# Altium schematic sheet Port.SchDoc
size A4
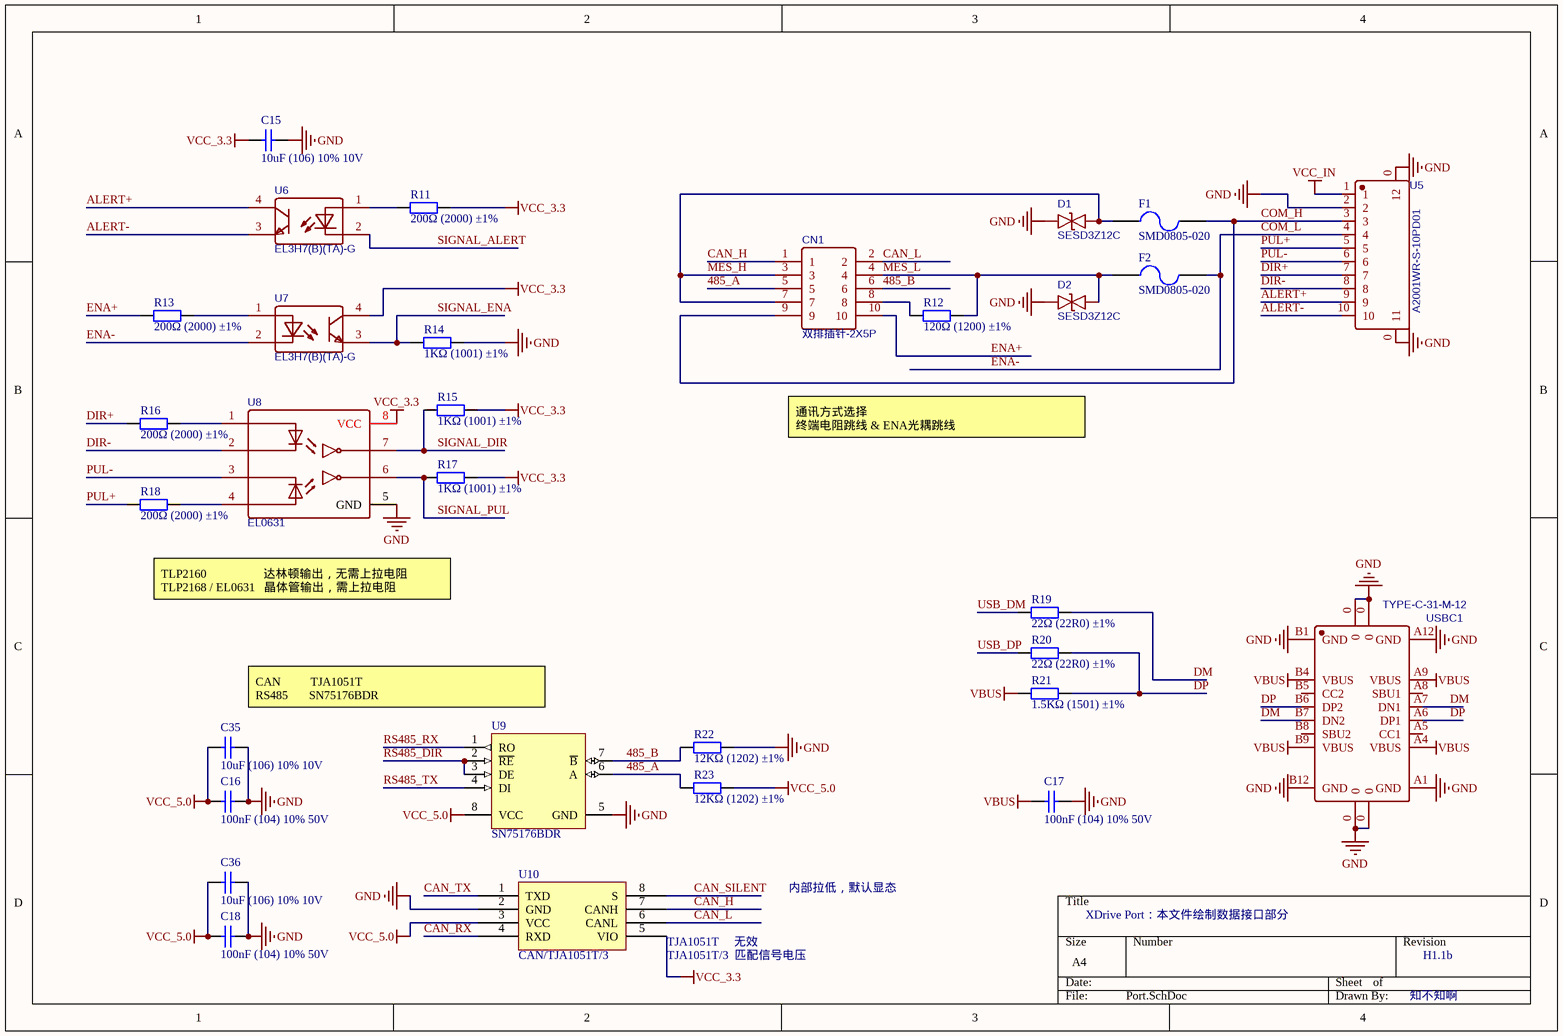
[diagram p0: Port.SchDoc]

## Parts
C15  10uF (106) 10% 10V  [0603_C]
C16  100nF (104) 10% 50V  [0603_C]
C17  100nF (104) 10% 50V  [0603_C]
C18  100nF (104) 10% 50V  [0603_C]
C35  10uF (106) 10% 10V  [0603_C]
C36  10uF (106) 10% 10V  [0603_C]
CN1  双排插针-2X5P  [A2005WV-2X5P]
D1  SESD3Z12C  [SOD-323]
D2  SESD3Z12C  [SOD-323]
F1  SMD0805-020  [FU 0805]
F2  SMD0805-020  [FU 0805]
R11  200Ω (2000) ±1%  [0603_R]
R12  120Ω (1200) ±1%  [0805_R]
R13  200Ω (2000) ±1%  [0603_R]
R14  1KΩ (1001) ±1%  [0603_R]
R15  1KΩ (1001) ±1%  [0603_R]
R16  200Ω (2000) ±1%  [0603_R]
R17  1KΩ (1001) ±1%  [0603_R]
R18  200Ω (2000) ±1%  [0603_R]
R19  22Ω (22R0) ±1%  [0603_R]
R20  22Ω (22R0) ±1%  [0603_R]
R21  1.5KΩ (1501) ±1%  [0603_R]
R22  12KΩ (1202) ±1%  [0603_R]
R23  12KΩ (1202) ±1%  [0603_R]
U5  A2001WR-S-10PD01  [PH2.0-WS-10P]
U6  EL3H7(B)(TA)-G  [SOP4]
U7  EL3H7(B)(TA)-G  [SOP4]
U8  EL0631  [SOIC-8_L5.0-W4.0-P1.27-LS6.0-BL]
U9  SN75176BDR  [SOIC_8]
U10  CAN/TJA1051T/3  [SOIC_8]
USBC1  TYPE-C-31-M-12  [USB-C_SMD-TYPE-C-31-M-12]

## Nets
GND: C15.2 C16.2 C17.2 C18.2 C35.1 C36.1 D1.1 D2.1 R14.1 R22.2 U5.0(11) U5.2 U8.5(GND) U9.5(GND) U10.2(GND) USBC1.0 USBC1.A1(GND) USBC1.A12(GND) USBC1.B1(GND) USBC1.B12(GND)
VBUS: C17.1 R21.1 USBC1.A4(VBUS) USBC1.A9(VBUS) USBC1.B4(VBUS) USBC1.B9(VBUS)
VCC_3.3: C15.1 R11.2 R15.1 R17.1 U7.4(COL) U8.8(VCC) U10.5(VIO)
VCC_5.0: C16.1 C18.1 C35.2 C36.2 R23.2 U9.8(VCC) U10.3(VCC)
VCC_IN: U5.1
485_A: CN1.5 R23.1 U9.6(A)
485_B: CN1.6 R22.1 U9.7(~{B})
ALERT+: U5.9 U6.4(COL)
ALERT-: U5.10 U6.3(EM)
CAN_H: CN1.1 U10.7(CANH)
CAN_L: CN1.2 U10.6(CANL)
CAN_RX: U10.4(RXD)
CAN_SILENT: U10.8(S)
CAN_TX: U10.1(TXD)
COM_H: CN1.9 F1.2 U5.3
COM_L: F2.2 U5.4 U7.2(CA)  [also labelled ENA-]
DIR+: R16.1 U5.7
DIR-: U5.8 U8.2(CAT1)
DM: R19.2 USBC1.A7(DN1) USBC1.B7(DN2)
DP: R20.2 R21.2 USBC1.A6(DP1) USBC1.B6(DP2)
ENA+: CN1.10 R13.1
MES_H: CN1.3 CN1.7 D1.2 F1.1
MES_L: CN1.4 D2.2 F2.1 R12.1
PUL+: R18.1 U5.5
PUL-: U5.6 U8.3(CAT2)
RS485_DIR: U9.2(~{RE}) U9.3(DE)
RS485_RX: U9.1(RO)
RS485_TX: U9.4(DI)
SIGNAL_ALERT: U6.2(CA)
SIGNAL_DIR: R15.2 U8.7(VO1)
SIGNAL_ENA: R14.2 U7.3(EM)
SIGNAL_PUL: R17.2 U8.6(VO2)
USB_DM: R19.1
USB_DP: R20.1
NetCN1_8: CN1.8 R12.2
NetR11_1: R11.1 U6.1(AN)
NetR13_2: R13.2 U7.1(AN)
NetR16_2: R16.2 U8.1(AN1)
NetR18_2: R18.2 U8.4(AN2)

Not connected (* = marked no-connect by the designer): USBC1 A5(CC1) A8(SBU1) B5(CC2) B8(SBU2)

## Notes on the sheet
- 通讯方式选择
  终端电阻跳线 & ENA光耦跳线
- TLP2160                   达林顿输出，无需上拉电阻
  TLP2168 / EL0631   晶体管输出，需上拉电阻
- CAN          TJA1051T
  RS485       SN75176BDR
- 内部拉低，默认显态
- XDrive Port：本文件绘制数据接口部分
- (near U10) TJA1051T     无效
- (near U10) TJA1051T/3  匹配信号电压
- H1.1b
- 知不知啊

## Library data of the parts
C15 C35 C36 = 0603 10uF (106) 10% 10V: 贴片电容; ComponentLink1Description: 供应商链接; ComponentLink1URL: http://www.szlcsc.com/product/details_20411.html; Package: 0603; Supplier: LC; SuppliersPartNumber: C19702
C16-C18 = 0603 100nF (104) 10% 50V: 贴片电容; ComponentLink1Description: 供应商链接; ComponentLink1URL: http://www.szlcsc.com/product/details_15331.html; Package: 0603; Supplier: LC; SuppliersPartNumber: C14663
CN1 = A2005WV-2X5P: 双排插针-2.0mm; BOM_Manufacturer: Changjiang Connectors; Contributor: LCSC; BOM_Supplier: LCSC; BOM_Supplier Part: C225290; BOM_Manufacturer Part: A2005WV-2x5P; spicePre: C; spiceSymbolName: A2005WV-2X5P
D1 D2 = SESD3Z12C: 双向ESD; BOM_Manufacturer: SINO-IC; Contributor: LCSC; BOM_Supplier: LCSC; BOM_Supplier Part: C355241; BOM_Manufacturer Part: SESD3Z12C; spicePre: D; spiceSymbolName: SESD3Z12C
F1 F2 = Fuse 2: 自恢复保险丝 200mA; Published: 8-Jun-2000; LatestRevisionDate: 17-Jul-2002; LatestRevisionNote: Re-released for DXP Platform.; PackageReference: PIN-W2/E2.8; Publisher: Altium Limited; PackageDescription: Thru-Hole; 2 Leads
R11 R13 R16 R18 = 0603 200Ω (2000) 1%: 贴片电阻; ComponentLink1Description: 供应商链接; ComponentLink1URL: http://www.szlcsc.com/product/details_8708.html; Package: 0603; Supplier: LC; SuppliersPartNumber: C8218
R12 = 0805 120Ω (1200) 1%: 贴片电阻; ComponentLink1Description: 供应商链接; ComponentLink1URL: http://www.szlcsc.com/product/details_18125.html; Package: 0805; Supplier: LC; SuppliersPartNumber: C17437
R14 R15 R17 = 0603 1KΩ (1001) 1%: 贴片电阻; ComponentLink1Description: 供应商链接; ComponentLink1URL: http://www.szlcsc.com/product/details_21904.html; Package: 0603; Supplier: LC; SuppliersPartNumber: C21190
R19 R20 = 0603 22Ω (22R0) 1%: 贴片电阻; ComponentLink1Description: 供应商链接; ComponentLink1URL: http://www.szlcsc.com/product/details_24078.html; Package: 0603; Supplier: LC; SuppliersPartNumber: C23345
R21 = 0603 1.5KΩ (1501) 1%: 贴片电阻; ComponentLink1Description: 供应商链接; ComponentLink1URL: http://www.szlcsc.com/product/details_23570.html; Package: 0603; Supplier: LC; SuppliersPartNumber: C22843
R22 R23 = 0603 12KΩ (1202) 1%: 贴片电阻; ComponentLink1Description: 供应商链接; ComponentLink1URL: http://www.szlcsc.com/product/details_23517.html; Package: 0603; Supplier: LC; SuppliersPartNumber: C22790
U5 = A2001WR-S-10PD01: 贴片PH2.0插座; BOM_Manufacturer: HR; Contributor: LCSC; BOM_Supplier: LCSC; BOM_Supplier Part: C278796; BOM_Manufacturer Part: A2001WR-S-10PD01; spicePre: U
U6 U7 = EL357N(A)(TA)-G: 光耦; BOM_Manufacturer: EVERLIGHT; Contributor: LCSC; SMT Type: Extend; BOM_Supplier: LCSC; BOM_Manufacturer Part: EL357N(A)(TA)-G; BOM_Supplier Part: C142286; BOM_LCSC Assembly: Yes; spicePre: U; spiceSymbolName: EL357N(A)(TA)-G
U8 = TLP2160(TP,F): 光耦; BOM_Manufacturer: TOSHIBA; Contributor: LCSC; BOM_Supplier: LCSC; BOM_Supplier Part: C393887; BOM_Manufacturer Part: TLP2160(TP,F); spicePre: U; spiceSymbolName: TLP2160(TP,F)
U9 = SN75176BDR_[C7063]: RS-485/RS-422; ComponentLink1Description: 供应商链接; ComponentLink1URL: http://www.szlcsc.com/product/details_7535.html; Package: SOIC-8_150mil; Supplier: LC; SuppliersPartNumber: C7063
U10 = CAN/TJA1051T/3_[C38695]: CAN; ComponentLink1Description: 供应商链接; ComponentLink1URL: http://www.szlcsc.com/product/details_39678.html; Package: SOIC-8_150mil; Supplier: LC; SuppliersPartNumber: C38695
USBC1 = TYPE-C-31-M-12: TYPE-C USB插座; BOM_Manufacturer: Rectangular Connectors - Contacts; Contributor: LCSC; BOM_Supplier: LCSC; BOM_Supplier Part: C165948; BOM_Manufacturer Part: TYPE-C-31-M-12; spicePre: U; spiceSymbolName: TYPE-C-31-M-12